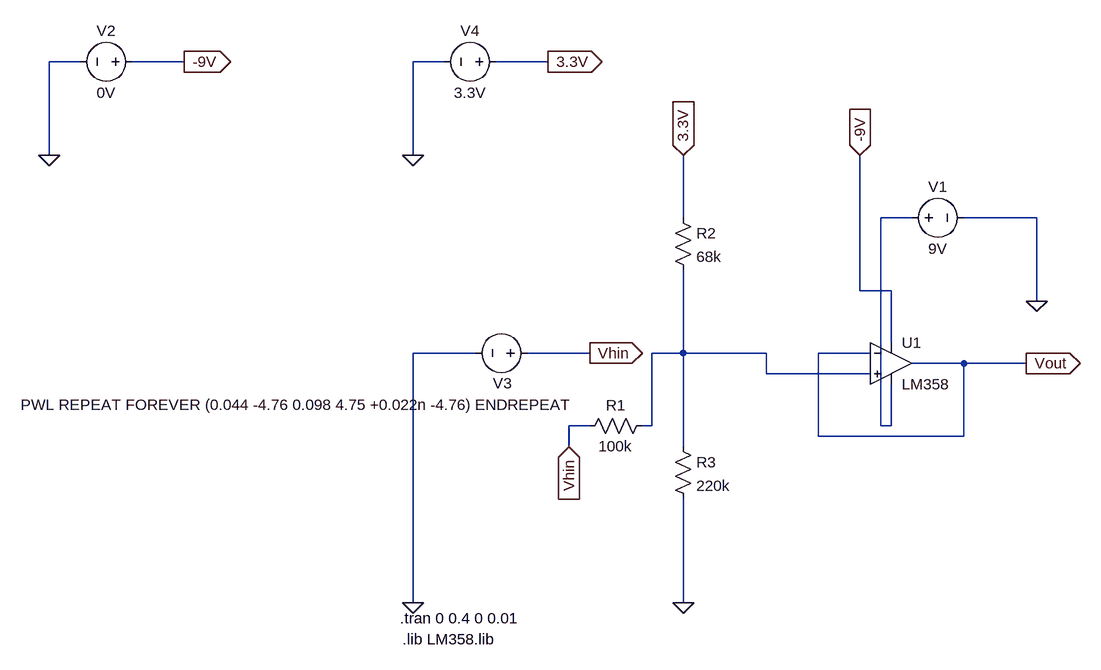
[diagram p0: schematic ssc-hsc-simulation.asc]
ssc-hsc-simulation.asc, the LTspice schematic file:
Version 4
SHEET 1 880 680
WIRE -1040 -304 -1088 -304
WIRE -880 -304 -960 -304
WIRE -480 -304 -528 -304
WIRE -320 -304 -400 -304
WIRE -1088 -160 -1088 -304
WIRE -528 -160 -528 -304
WIRE -112 -64 -112 -160
WIRE 240 -64 192 -64
WIRE 432 -64 320 -64
WIRE 160 48 160 -160
WIRE 208 48 160 48
WIRE 432 64 432 -64
WIRE 208 128 208 48
WIRE -432 144 -528 144
WIRE -256 144 -352 144
WIRE -112 144 -112 16
WIRE -112 144 -160 144
WIRE 16 144 -112 144
WIRE 176 144 96 144
WIRE 320 160 240 160
WIRE 416 160 320 160
WIRE 16 176 16 144
WIRE 176 176 16 176
WIRE -256 256 -288 256
WIRE -160 256 -160 144
WIRE -160 256 -176 256
WIRE 192 256 192 -64
WIRE 208 256 208 192
WIRE 208 256 192 256
WIRE 96 272 96 144
WIRE 320 272 320 160
WIRE 320 272 96 272
WIRE -288 288 -288 256
WIRE -112 288 -112 144
WIRE -528 528 -528 144
WIRE -112 528 -112 368
FLAG 416 160 Vout
IOPIN 416 160 Out
FLAG -112 528 0
FLAG -528 528 0
FLAG 432 64 0
FLAG -112 -160 3.3V
IOPIN -112 -160 In
FLAG -320 -304 3.3V
IOPIN -320 -304 Out
FLAG -528 -160 0
FLAG -256 144 Vhin
IOPIN -256 144 Out
FLAG -288 288 Vhin
IOPIN -288 288 In
FLAG -880 -304 -9V
IOPIN -880 -304 Out
FLAG -1088 -160 0
FLAG 160 -160 -9V
IOPIN 160 -160 In
SYMBOL res -160 240 R90
WINDOW 0 0 56 VBottom 2
WINDOW 3 32 56 VTop 2
SYMATTR InstName R1
SYMATTR Value 100k
SYMBOL res -128 -80 R0
SYMATTR InstName R2
SYMATTR Value 68k
SYMBOL res -128 272 R0
SYMATTR InstName R3
SYMATTR Value 220k
SYMBOL voltage 224 -64 R270
WINDOW 0 32 56 VTop 2
WINDOW 3 -32 56 VBottom 2
SYMATTR InstName V1
SYMATTR Value 9V
SYMBOL voltage -336 144 R90
WINDOW 0 62 54 VBottom 2
WINDOW 3 64 369 VTop 2
WINDOW 123 0 0 Left 0
WINDOW 39 0 0 Left 0
SYMATTR InstName V3
SYMATTR Value PWL REPEAT FOREVER (0.044 -4.76 0.098 4.75 +0.022n -4.76) ENDREPEAT
SYMBOL voltage -384 -304 R90
WINDOW 0 -32 56 VBottom 2
WINDOW 3 32 56 VTop 2
SYMATTR InstName V4
SYMATTR Value 3.3V
SYMBOL OpAmps\\opamp2 208 96 R0
SYMATTR InstName U1
SYMATTR Value LM358
SYMBOL voltage -944 -304 R90
WINDOW 0 -32 56 VBottom 2
WINDOW 3 32 56 VTop 2
SYMATTR InstName V2
SYMATTR Value 0V
TEXT -548 552 Left 2 !.tran 0 0.4 0 0.01
TEXT -544 584 Left 2 !.lib LM358.lib

The netlist it stands for:
* ssc-hsc-simulation.asc
R1 N002 Vhin 100k
R2 3.3V N002 68k
R3 N002 0 220k
V1 N001 0 9V
V3 Vhin 0 PWL REPEAT FOREVER (0.044 -4.76 0.098 4.75 +0.022n -4.76) ENDREPEAT
V4 3.3V 0 3.3V
XU1 N002 Vout -9V N001 Vout LM358  ; pins In+ In- V+ V- OUT
V2 -9V 0 0V
.tran 0 0.4 0 0.01
.lib LM358.lib
.backanno
.end